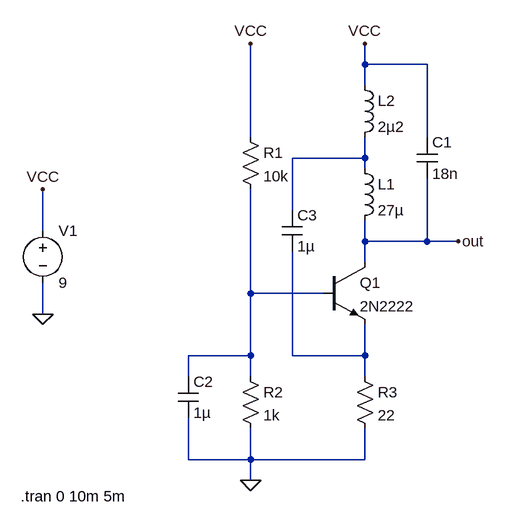
[diagram p0: schematic Draft1.asc]
Draft1.asc, the LTspice schematic file:
Version 4
SHEET 1 880 680
WIRE 288 -112 288 -144
WIRE 384 -112 288 -112
WIRE 288 -80 288 -112
WIRE 112 0 112 -144
WIRE 384 0 384 -112
WIRE 288 32 288 0
WIRE 288 32 176 32
WIRE 288 48 288 32
WIRE 176 112 176 32
WIRE -208 144 -208 80
WIRE 288 160 288 128
WIRE 384 160 384 64
WIRE 384 160 288 160
WIRE 432 160 384 160
WIRE 288 192 288 160
WIRE 112 240 112 80
WIRE 224 240 112 240
WIRE -208 272 -208 224
WIRE 112 336 112 240
WIRE 112 336 16 336
WIRE 176 336 176 176
WIRE 288 336 288 288
WIRE 288 336 176 336
WIRE 16 368 16 336
WIRE 112 368 112 336
WIRE 288 368 288 336
WIRE 16 496 16 432
WIRE 112 496 112 448
WIRE 112 496 16 496
WIRE 288 496 288 448
WIRE 288 496 112 496
WIRE 112 528 112 496
FLAG -208 272 0
FLAG -208 80 VCC
FLAG 112 -144 VCC
FLAG 288 -144 VCC
FLAG 432 160 out
FLAG 112 528 0
SYMBOL npn 224 192 R0
SYMATTR InstName Q1
SYMATTR Value 2N2222
SYMBOL res 96 -16 R0
SYMATTR InstName R1
SYMATTR Value 10k
SYMBOL res 96 352 R0
SYMATTR InstName R2
SYMATTR Value 1k
SYMBOL ind 272 32 R0
SYMATTR InstName L1
SYMATTR Value 27µ
SYMBOL ind 272 -96 R0
SYMATTR InstName L2
SYMATTR Value 2µ2
SYMBOL cap 368 0 R0
SYMATTR InstName C1
SYMATTR Value 18n
SYMBOL res 272 352 R0
SYMATTR InstName R3
SYMATTR Value 22
SYMBOL cap 0 368 R0
SYMATTR InstName C2
SYMATTR Value 1µ
SYMBOL cap 160 112 R0
SYMATTR InstName C3
SYMATTR Value 1µ
SYMBOL voltage -208 128 R0
SYMATTR InstName V1
SYMATTR Value 9
TEXT -242 552 Left 2 !.tran 0 10m 5m

The netlist it stands for:
* Draft1.asc
Q1 out N002 N003 0 2N2222
R1 VCC N002 10k
R2 N002 0 1k
L1 N001 out 27µ
L2 VCC N001 2µ2
C1 VCC out 18n
R3 N003 0 22
C2 N002 0 1µ
C3 N001 N003 1µ
V1 VCC 0 9
.model NPN NPN
.model PNP PNP
.lib standard.bjt
.tran 0 10m 5m
.backanno
.end